# EAGLE design eagle-import-testfile (EAGLE 8.2.1)

## Sheet 1 of 2: Sheet1
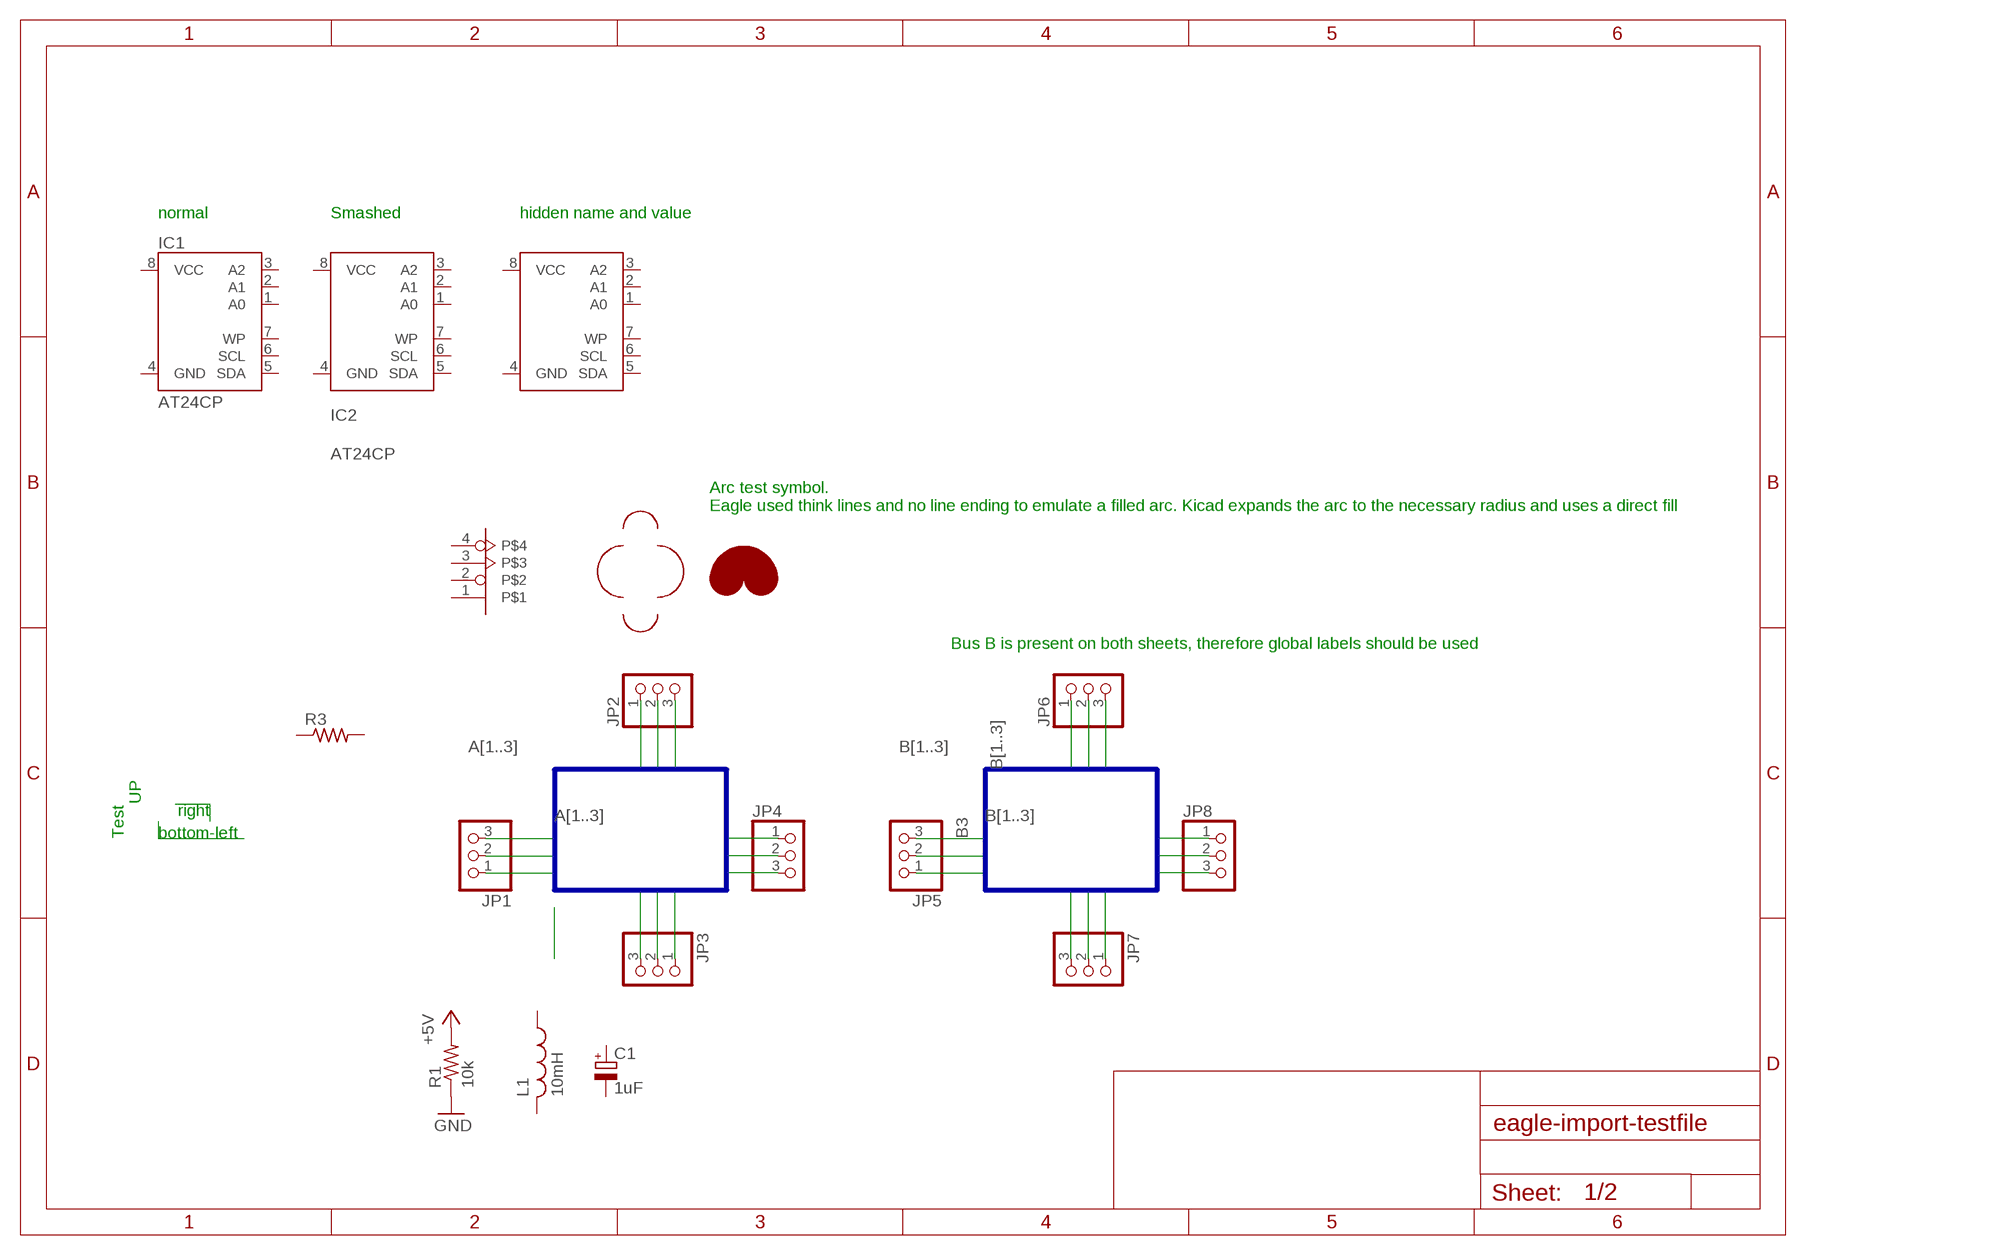
[diagram p0: schematic, sheet 1]

### Parts
C1  1uF  CPOL-EU085CS-1AR  [085CS_1AR]
IC1  AT24CP  [DIL08]
IC2  AT24CP  [DIL08]
IC3  AT24CP  [DIL08]
JP1  PINHD-1X3  [1X03]
JP2  PINHD-1X3  [1X03]
JP3  PINHD-1X3  [1X03]
JP4  PINHD-1X3  [1X03]
JP5  PINHD-1X3  [1X03]
JP6  PINHD-1X3  [1X03]
JP7  PINHD-1X3  [1X03]
JP8  PINHD-1X3  [1X03]
L1  10mH  L-USL2012C  [L2012C]
R1  10k  R-US_R0603  [R0603]
R3  R-US_0204/2V  [0204V]
U$2  PINSHAPETEST  [1X04]

### Nets
+5V: R1.2
A1: JP1.1 JP2.1 JP3.1 JP4.1
A2: JP1.2 JP2.2 JP3.2 JP4.2
A3: JP1.3 JP2.3 JP3.3 JP4.3
B1: JP5.1 JP6.1 JP7.3 JP8.1 ; also sheet 2
B2: JP5.2 JP6.2 JP7.2 JP8.2 ; also sheet 2
B3: JP5.3 JP6.3 JP7.1 JP8.3 ; also sheet 2
GND: R1.1
Unconnected: C1.+ C1.- IC1.1(A0) IC1.2(A1) IC1.3(A2) IC1.5(SDA) IC1.6(SCL) IC1.7(WP) IC2.1(A0) IC2.2(A1) IC2.3(A2) IC2.5(SDA) IC2.6(SCL) IC2.7(WP) IC3.1(A0) IC3.2(A1) IC3.3(A2) IC3.5(SDA) IC3.6(SCL) IC3.7(WP) L1.1 L1.2 R3.1 R3.2 U$2.1 U$2.2 U$2.3 U$2.4

### Buses
A[1..3]
B[1..3]

### Notes on the sheet
- normal | Smashed | hidden name and value
- Arc test symbol.
  Eagle used think lines and no line ending to emulate a filled arc. Kicad expands the arc to the necessary radius and uses a direct fill
- Bus B is present on both sheets, therefore global labels should be used
- UP | right
- Test | bottom-left

## Sheet 2 of 2
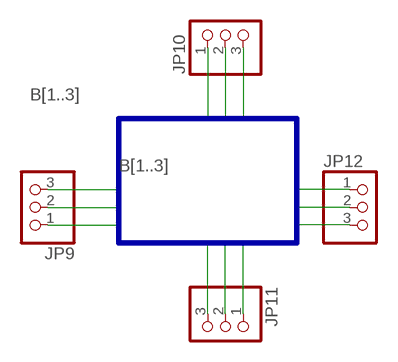
[diagram p1: schematic, sheet 2]

### Parts
JP9  PINHD-1X3  [1X03]
JP10  PINHD-1X3  [1X03]
JP11  PINHD-1X3  [1X03]
JP12  PINHD-1X3  [1X03]

### Nets
B1: JP9.1 JP10.1 JP11.3 JP12.1 ; also sheet 1
B2: JP9.2 JP10.2 JP11.2 JP12.2 ; also sheet 1
B3: JP9.3 JP10.3 JP11.1 JP12.3 ; also sheet 1

### Buses
B[1..3]

## Power pins joined to a net without a drawn wire
GND: IC1.4(GND) IC2.4(GND) IC3.4(GND)
VCC: IC1.8(VCC) IC2.8(VCC) IC3.8(VCC)

## Library data of the parts
C1 = rcl:CPOL-EU: POLARIZED CAPACITOR, European symbol
IC1-IC3 = atmel:AT24C*: 2-wire serial EEPROM; MPN: AT24C1024BW-SH-B; OC_FARNELL: 1362646; OC_NEWARK: 03P2044
JP1-JP12 = pinhead:PINHD-1X3: PIN HEADER
L1 = rcl:L-US: INDUCTOR, American symbol
R1 R3 = resistor:R-US_: RESISTOR, American symbol
U$2 = pinhead:PINSHAPETEST

## Board
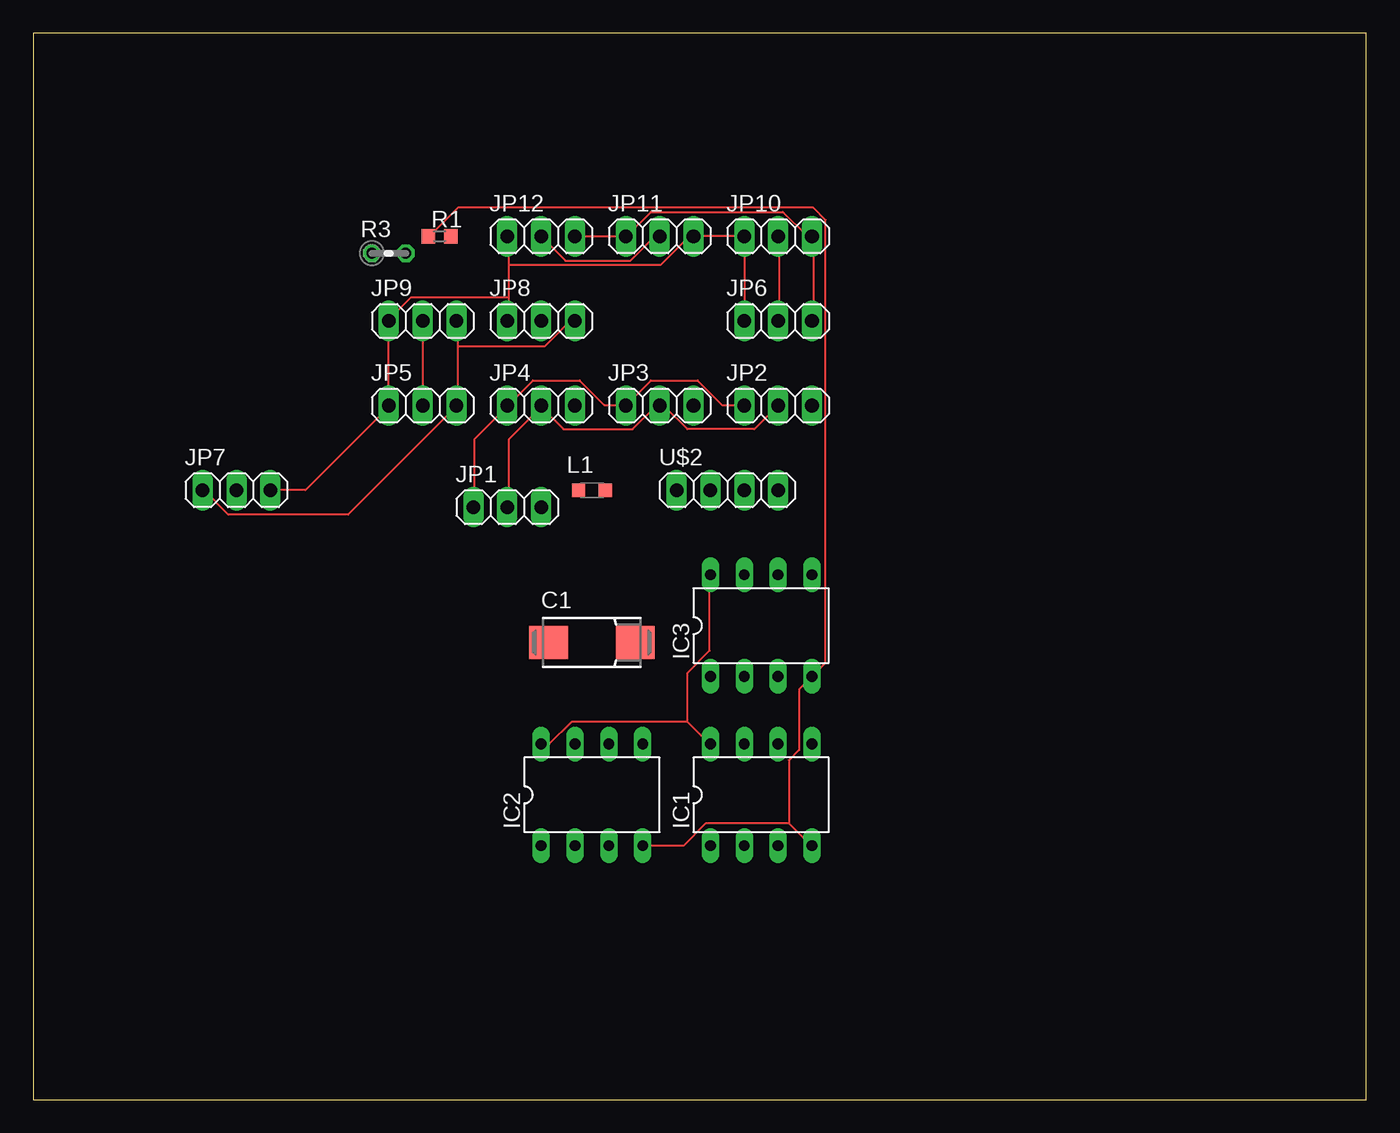
[diagram p2: board, top side]
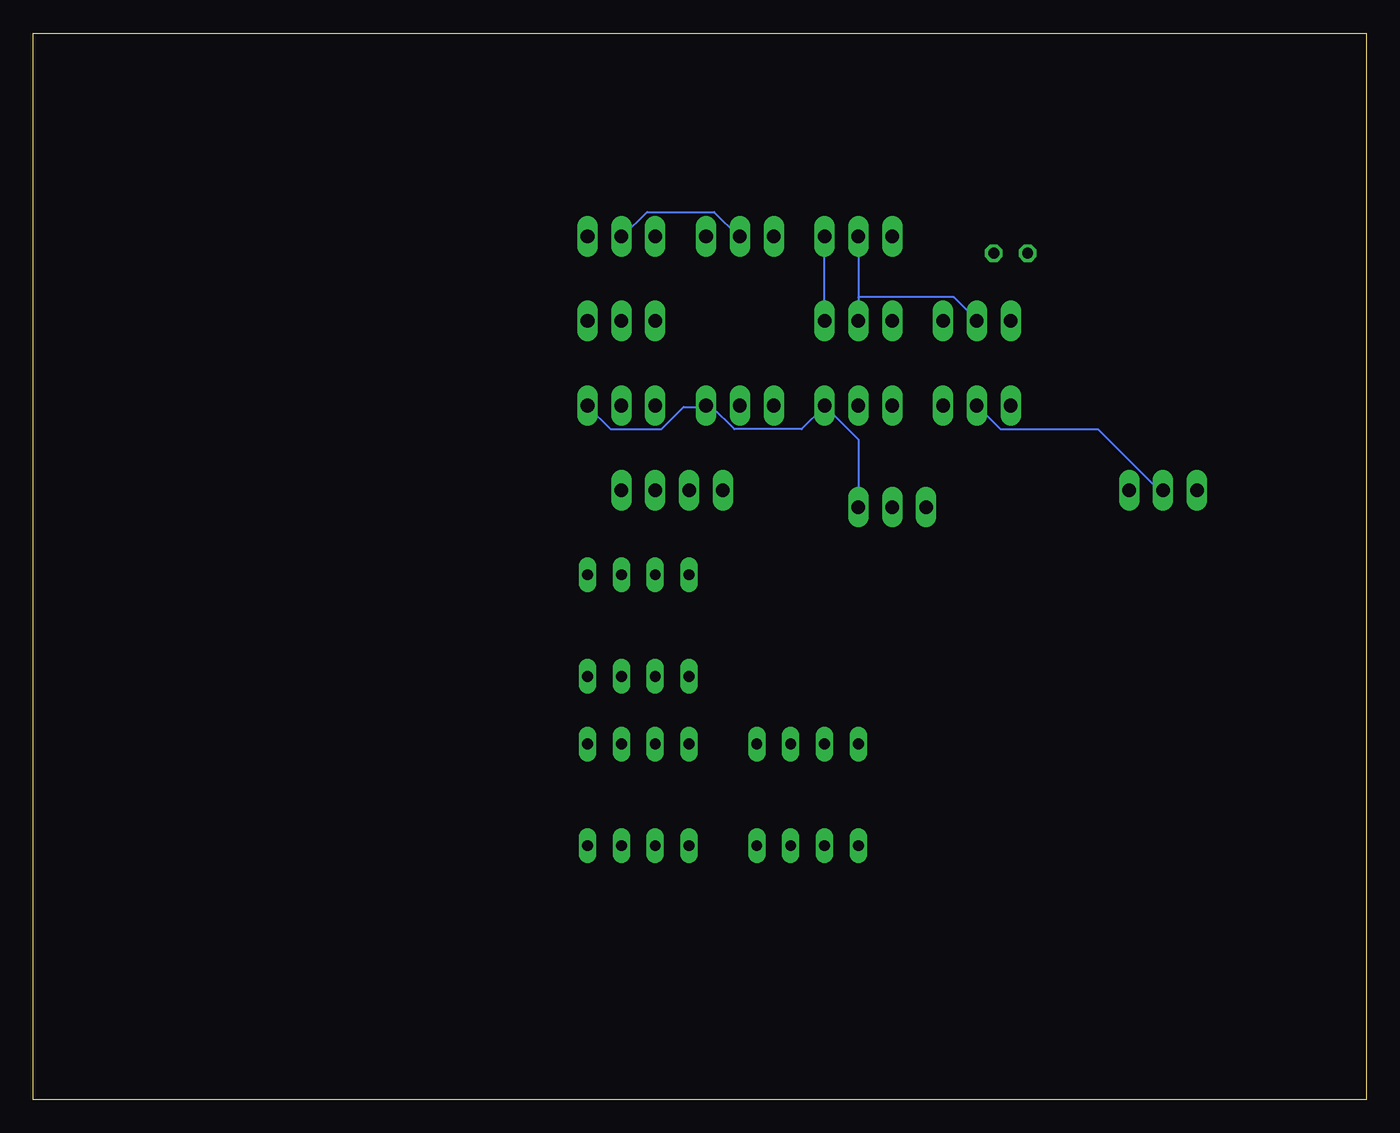
[diagram p3: board, bottom side, seen from below]

Size 100 x 80 mm. Coordinates in mm from the lower left corner, seen from the top.
Outline: 0,0 100,0 100,80 0,80 0,0
Copper layers (1*16): Top 0.035mm / dielectric 1.5mm / Bottom 0.035mm
Design rules "default": minimum track width 6mil, minimum drill 0.35mm, track to track 6mil, track to pad 6mil, pad to pad 6mil, via to via 6mil, smd to smd 6mil, copper to edge 40mil, drill to drill 6mil, minimum pad ring 10mil, minimum via ring 8mil, stop-mask expansion 4mil, vias tented up to drill 0mil, thermal gap 10mil

### Footprints (pad centres in the part's own frame; a part is rotated, then mirrored left to right if it is on the bottom)
085CS_1AR = smd 2.9 x 2.5: + 3.25,0; - -3.25,0
DIL08 = drill 0.813 long: 1 -3.81,-3.81; 2 -1.27,-3.81; 3 1.27,-3.81; 4 3.81,-3.81; 5 3.81,3.81; 6 1.27,3.81; 7 -1.27,3.81; 8 -3.81,3.81
1X03 = drill 1.016 long: 1 -2.54,0; 2 0,0; 3 2.54,0
L2012C = smd 1 x 1: 1 -1,0; 2 1,0
R0603 = smd 1 x 1.1: 1 -0.85,0; 2 0.85,0
0204V = drill 0.813 octagon: 1 -1.27,0; 2 1.27,0
1X04 = drill 1.016 long: 1 -3.81,0; 2 -1.27,0; 3 1.27,0; 4 3.81,0

### Placement (x,y rotation side)
C1  41.91,34.29 0 top
IC1  54.61,22.86 0 top
IC2  41.91,22.86 0 top
IC3  54.61,35.56 0 top
JP1  35.56,44.45 0 top
JP2  55.88,52.07 0 top
JP3  46.99,52.07 0 top
JP4  38.1,52.07 0 top
JP5  29.21,52.07 0 top
JP6  55.88,58.42 0 top
JP7  15.24,45.72 0 top
JP8  38.1,58.42 0 top
JP9  29.21,58.42 0 top
JP10  55.88,64.77 0 top
JP11  46.99,64.77 0 top
JP12  38.1,64.77 0 top
L1  41.91,45.72 0 top
R1  30.48,64.77 0 top
R3  26.67,63.5 0 top
U$2  52.07,45.72 0 top

### Tracks (layer width: path | path; a pad name or v marks a point on that pad's centre or on a via)
A1
  Top 0.152: JP1.1 33.07,44.5 33.07,49.53 35.51,51.97 JP4.1 35.66,52.12 37.49,53.95 41,53.95 42.82,52.12 44.35,52.12 JP3.1 46.33,53.95 49.84,53.95 51.66,52.12 53.34,52.12 JP2.1
A2
  Top 0.152: JP2.2 54.1,50.29 49.07,50.29 47.4,51.97 47.09,51.97 JP3.2 46.94,51.97 46.63,51.97 44.96,50.29 39.78,50.29 38.1,51.97 | 38.1,51.97 35.66,49.53 35.66,44.5 JP1.2 | 38.1,51.97 JP4.2
A3
  Bottom 0.152: 49.53,51.97 51.21,51.97 52.88,50.29 56.69,50.29 58.37,51.97 JP2.3 | JP1.3 38.1,49.53 JP4.3 40.69,51.97 42.37,50.29 47.4,50.29 49.07,51.97 49.53,51.97 | 49.53,51.97 JP3.3
B1
  Top 0.152: JP6.1 JP10.1 JP11.3 49.23,64.77 47.09,62.64 35.66,62.64 | 35.66,62.64 35.66,64.77 JP12.1 | 35.66,62.64 35.66,60.2 | 35.66,60.2 35.66,58.52 JP8.1 | JP7.3 20.42,45.72 26.67,51.97 JP5.1 JP9.1 26.67,58.52 28.35,60.2 35.66,60.2
B2
  Top 0.152: JP6.2 55.93,58.52 55.93,64.77 JP10.2 | JP9.2 29.26,58.37 29.26,52.12 JP5.2 | JP11.2 46.63,64.77 44.81,62.94 39.93,62.94 JP12.2
  Bottom 0.152: JP11.2 47.09,64.77 48.92,66.6 53.95,66.6 55.78,64.77 JP10.2 | JP12.2 38.1,60.2 | 38.1,60.2 JP8.2 | JP7.2 15.54,45.72 20.12,50.29 27.43,50.29 JP5.2 | 38.1,60.2 30.94,60.2 29.26,58.52 JP9.2
B3
  Top 0.152: JP6.3 58.52,58.52 58.52,64.77 JP10.3 58.06,64.77 56.24,66.6 46.33,66.6 44.5,64.77 JP11.1 JP12.3 | JP7.1 12.8,45.72 14.63,43.89 23.62,43.89 31.7,51.97 JP5.3 31.85,52.12 31.85,56.54 | 31.85,56.54 31.85,58.37 JP9.3 | 31.85,56.54 38.41,56.54 40.23,58.37 40.54,58.37 JP8.3
  Bottom 0.152: JP8.3 40.69,58.52 40.69,64.77 JP12.3
GND
  Top 0.152: IC2.4 48.77,19.05 50.44,20.73 56.69,20.73 | 56.69,20.73 58.37,19.05 IC1.4 | R1.1 29.72,64.77 31.85,66.9 58.52,66.9 59.44,65.99 59.44,32.77 IC3.4 57.45,30.79 57.45,26.21 56.69,25.45 56.69,20.73
VCC
  Top 0.152: IC2.8 38.71,26.67 40.39,28.35 49.07,28.35 | 49.07,28.35 50.75,26.67 IC1.8 | 49.07,28.35 49.07,32 50.75,33.68 50.75,39.32 IC3.8